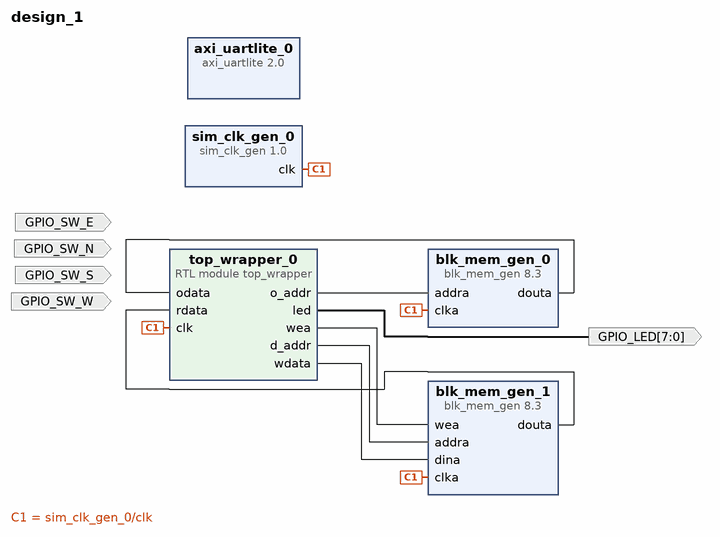
[diagram p0: block diagram of the top level]
# Vivado block design design_1, xcku040-ffva1156-2-e, Vivado 2016.4
create_bd_design design_1

create_bd_port -dir O -from 7 -to 0 -type data GPIO_LED
create_bd_port -dir I -type data GPIO_SW_W
create_bd_port -dir I -type data GPIO_SW_S
create_bd_port -dir I -type data GPIO_SW_E
create_bd_port -dir I -type data GPIO_SW_N

create_bd_cell -type ip -vlnv xilinx.com:ip:blk_mem_gen:8.3 blk_mem_gen_0
set_property -dict [list \
  CONFIG.Enable_32bit_Address false \
  CONFIG.Use_Byte_Write_Enable false \
  CONFIG.Operating_Mode_A READ_FIRST \
  CONFIG.Enable_A Always_Enabled \
  CONFIG.Register_PortA_Output_of_Memory_Primitives false \
  CONFIG.Load_Init_File true \
  CONFIG.Coe_File ../../../../../../../fib.coe \
  CONFIG.Use_RSTA_Pin false \
  CONFIG.use_bram_block Stand_Alone \
] [get_bd_cells blk_mem_gen_0]
create_bd_cell -type ip -vlnv xilinx.com:ip:blk_mem_gen:8.3 blk_mem_gen_1
set_property -dict [list \
  CONFIG.Enable_32bit_Address false \
  CONFIG.Use_Byte_Write_Enable false \
  CONFIG.Enable_A Always_Enabled \
  CONFIG.Register_PortA_Output_of_Memory_Primitives false \
  CONFIG.Load_Init_File false \
  CONFIG.Use_RSTA_Pin false \
  CONFIG.use_bram_block Stand_Alone \
] [get_bd_cells blk_mem_gen_1]
create_bd_cell -type ip -vlnv xilinx.com:ip:sim_clk_gen:1.0 sim_clk_gen_0
create_bd_cell -type module -reference top_wrapper top_wrapper_0
create_bd_cell -type ip -vlnv xilinx.com:ip:axi_uartlite:2.0 axi_uartlite_0

# ---- connections ----

connect_bd_net [get_bd_pins top_wrapper_0/wea] [get_bd_pins blk_mem_gen_1/wea]
connect_bd_net [get_bd_pins top_wrapper_0/d_addr] [get_bd_pins blk_mem_gen_1/addra]
connect_bd_net [get_bd_pins top_wrapper_0/wdata] [get_bd_pins blk_mem_gen_1/dina]
connect_bd_net [get_bd_pins blk_mem_gen_1/douta] [get_bd_pins top_wrapper_0/rdata]
connect_bd_net [get_bd_pins top_wrapper_0/o_addr] [get_bd_pins blk_mem_gen_0/addra]
connect_bd_net [get_bd_pins blk_mem_gen_0/douta] [get_bd_pins top_wrapper_0/odata]
connect_bd_net [get_bd_pins top_wrapper_0/led] [get_bd_ports GPIO_LED]
# net GPIO_SW_W_1 has one end: GPIO_SW_W
# net GPIO_SW_S_1 has one end: GPIO_SW_S
# net GPIO_SW_E_1 has one end: GPIO_SW_E
# net GPIO_SW_N_1 has one end: GPIO_SW_N
connect_bd_net [get_bd_pins sim_clk_gen_0/clk] [get_bd_pins blk_mem_gen_0/clka] [get_bd_pins blk_mem_gen_1/clka] [get_bd_pins top_wrapper_0/clk]

validate_bd_design
save_bd_design
